# EAGLE design Moving_Head_V3.1 (EAGLE 9.3.0)

## Sheet 1 of 2
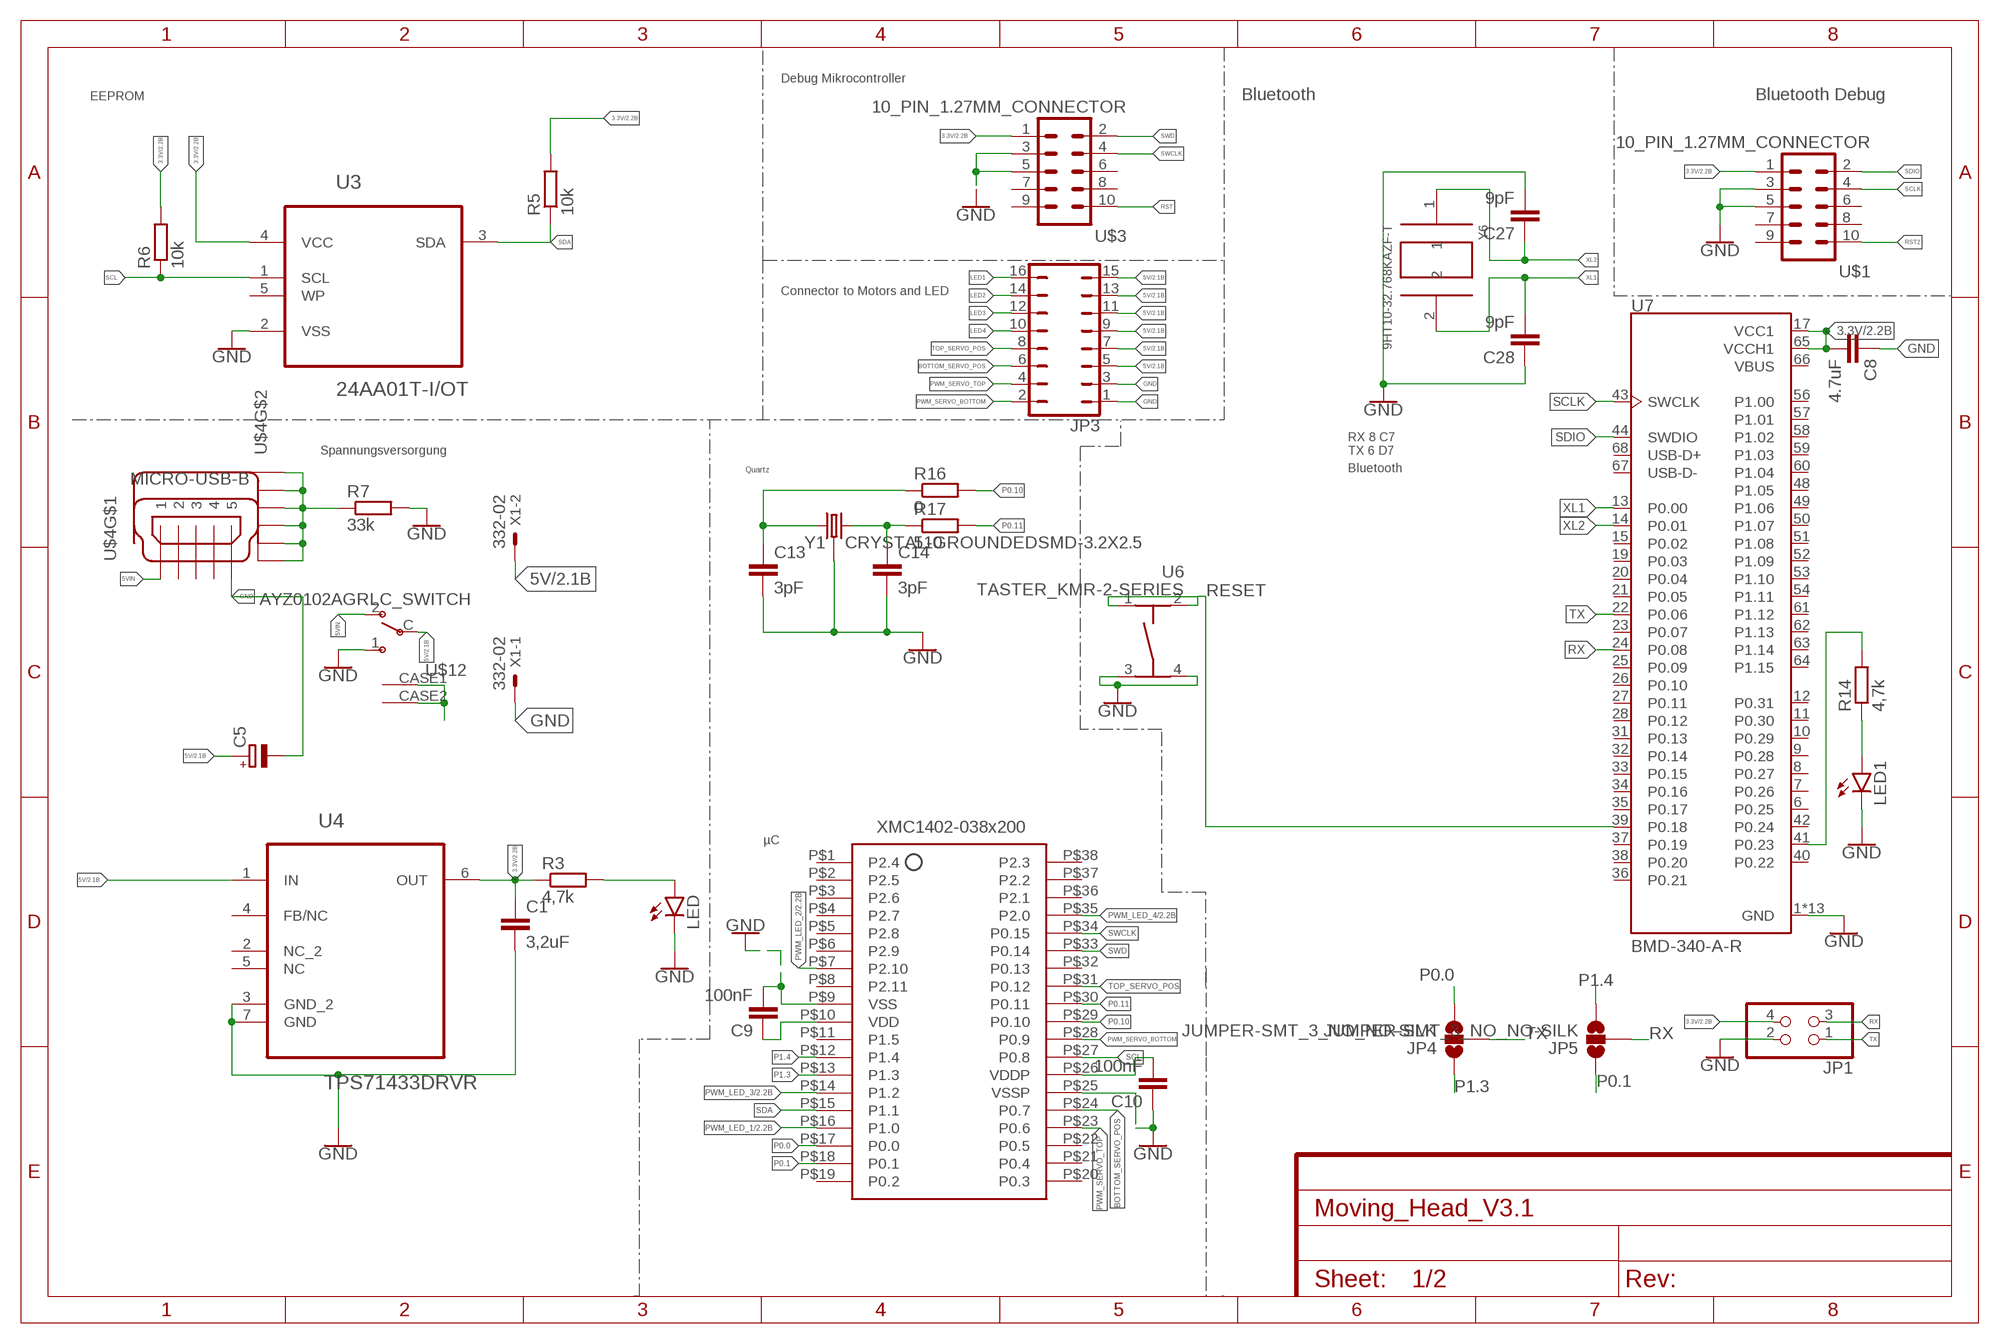
[diagram p0: schematic, sheet 1]

### Parts
C1  3,2uF  C-EUC0805  [C0805]
C5  CPOL-EUB/3528-21R  [B/3528-21R]
C8  4.7uF  C-EUC0805  [C0805]
C9  100nF  C-EUC0805  [C0805]
C10  100nF  C-EUC0805  [C0805]
C13  3pF  C-EUC0805  [C0805]
C14  3pF  C-EUC0805  [C0805]
C27  9pF  C-EUC0805  [C0805]
C28  9pF  C-EUC0805  [C0805]
JP1  PINHD-2X2  [2X02]
JP3  JUMPER_JP8Q  [JUMPER_JP8Q]
JP4  JUMPER-SMT_3_NO_NO-SILK  [SMT-JUMPER_3_NO_NO-SILK]
JP5  JUMPER-SMT_3_NO_NO-SILK  [SMT-JUMPER_3_NO_NO-SILK]
LED  LEDCHIPLED_0805  [CHIPLED_0805]
LED1  SML-H12V8TT86  LEDCHIPLED_0805  [CHIPLED_0805]
R3  4,7k  R-EU_R0805  [R0805]
R5  10k  R-EU_R0805  [R0805]
R6  10k  R-EU_R0805  [R0805]
R7  33k  R-EU_R0805  [R0805]
R14  4,7k  R-EU_R0805  [R0805]
R16  0  R-EU_R0805  [R0805]
R17  510  R-EU_R0805  [R0805]
U3  24AA01T-I/OT  [SOT95P270X145-5N]
U4  TPS71433DRVR  [SON65P200X200X80-7N]
U5  XMC1400_38P  [XMC1400_38P]
U6  TASTER_KMR-2-SERIES  [KMR-2-SERIES]
U7  BMD-340-A-R  [RIGADO_BMD-340-A-R]
U$1  10_PIN_1.27MM_CONNECTOR  [10_PIN_1.27MM]
U$3  10_PIN_1.27MM_CONNECTOR  [10_PIN_1.27MM]
U$4  MICRO-USB-B  [MICRO_USB_B]
U$12  AYZ0102AGRLC_SWITCH  [AYZ0102AGRLC]
X1  332-02  [332-02]
Y1  CRYSTAL-GROUNDEDSMD-3.2X2.5  [CRYSTAL-SMD-3.2X2.5MM]
Y6  9HT10-32.768KAZF-T  [XTAL320X150X75]

### Nets
3.3V: C1.1 C8.2 C9.1 C10.2 JP1.4 R3.1 R5.2 R6.2 U3.4(VCC) U4.6(OUT) U5.P$10(VDD) U5.P$26(VDDP) U7.17(VCC1) U7.65(VCCH1) U$1.1 U$3.1 ; also sheet 2
5V: C5.+ JP3.5 JP3.7 JP3.9 JP3.11 JP3.13 JP3.15 U4.1(IN) U$12.C X1.2 ; also sheet 2
5VIN: U$4.1 U$12.2
BOTTOM_SERVO_POS: JP3.6 U5.P$24(P0.7)
GND: C1.2 C5.- C8.1 C9.2 C10.1 C13.2 C14.2 C27.2 C28.1 JP1.2 JP3.1 JP3.3 LED1.C LED.C R7.2 U3.2(VSS) U4.3(GND_2) U4.7(GND) U5.P$9(VSS) U5.P$25(VSSP) U6.3 U6.4 U7.1(GND) U7.2(GND) U7.3(GND) U7.4(GND) U7.5(GND) U7.16(GND) U7.18(GND) U7.29(GND) U7.30(GND) U7.45(GND) U7.46(GND) U7.47(GND) U7.55(GND) U$1.3 U$1.5 U$3.3 U$3.5 U$4.5 U$12.1 U$12.CASE1 U$12.CASE2 X1.1 Y1.2 Y1.4 ; also sheet 2
LED1: JP3.16 ; also sheet 2
LED2: JP3.14 ; also sheet 2
LED3: JP3.12 ; also sheet 2
LED4: JP3.10 ; also sheet 2
N$1: R14.2 U7.41(P0.23)
N$2: LED1.A R14.1
N$4: LED.A R3.2
N$6: R7.1 U$4.P$1(S1) U$4.P$2(S2) U$4.P$6(S3) U$4.P$7(S4) U$4.P$9(S5) U$4.P$10(S6)
N$29: C14.1 R17.1 Y1.3
N$30: C13.1 R16.1 Y1.1
P0.0: JP4.3 U5.P$17(P0.0)
P0.1: JP5.1 U5.P$18(P0.1)
P0.10: R16.2 U5.P$29(P0.10)
P0.11: R17.2 U5.P$30(P0.11)
P1.3: JP4.1 U5.P$13(P1.3)
P1.4: JP5.3 U5.P$12(P1.4)
PWM_LED_1: U5.P$16(P1.0) ; also sheet 2
PWM_LED_2: U5.P$7(P2.10) ; also sheet 2
PWM_LED_3: U5.P$14(P1.2) ; also sheet 2
PWM_LED_4: U5.P$35(P2.0) ; also sheet 2
PWM_SERVO_BOTTOM: JP3.2 U5.P$28(P0.9)
PWM_SERVO_TOP: JP3.4 U5.P$23(P0.6)
RESET: U6.1 U6.2 U7.39(P0.18)
RST: U$3.10
RST2: U$1.10
RX: JP1.3 JP5.2 U7.24(P0.08)
SCL: R6.1 U3.1(SCL) U5.P$27(P0.8)
SCLK: U7.43(SWCLK) U$1.4
SDA: R5.1 U3.3(SDA) U5.P$15(P1.1)
SDIO: U7.44(SWDIO) U$1.2
SWCLK: U5.P$34(P0.15) U$3.4
SWD: U5.P$33(P0.14) U$3.2
TOP_SERVO_POS: JP3.8 U5.P$31(P0.12)
TX: JP1.1 JP4.2 U7.22(P0.06)
XL1: C28.2 U7.13(P0.00) Y6.2
XL2: C27.1 U7.14(P0.01) Y6.1
Unconnected: U3.5(WP) U4.2(NC_2) U4.4(FB/NC) U4.5(NC) U5.P$1(P2.4) U5.P$2(P2.5) U5.P$3(P2.6) U5.P$4(P2.7) U5.P$5(P2.8) U5.P$6(P2.9) U5.P$8(P2.11) U5.P$11(P1.5) U5.P$19(P0.2) U5.P$20(P0.3) U5.P$21(P0.4) U5.P$22(P0.5) U5.P$32(P0.13) U5.P$36(P2.1) U5.P$37(P2.2) U5.P$38(P2.3) U7.6(P0.25) U7.7(P0.26) U7.8(P0.27) U7.9(P0.28) U7.10(P0.29) U7.11(P0.30) U7.12(P0.31) U7.15(P0.02) U7.19(P0.03) U7.20(P0.04) U7.21(P0.05) U7.23(P0.07) U7.25(P0.09) U7.26(P0.10) U7.27(P0.11) U7.28(P0.12) U7.31(P0.13) U7.32(P0.14) U7.33(P0.15) U7.34(P0.16) U7.35(P0.17) U7.36(P0.21) U7.37(P0.19) U7.38(P0.20) U7.40(P0.22) U7.42(P0.24) U7.48(P1.05) U7.49(P1.06) U7.50(P1.07) U7.51(P1.08) U7.52(P1.09) U7.53(P1.10) U7.54(P1.11) U7.56(P1.00) U7.57(P1.01) U7.58(P1.02) U7.59(P1.03) U7.60(P1.04) U7.61(P1.12) U7.62(P1.13) U7.63(P1.14) U7.64(P1.15) U7.67(USB-D-) U7.68(USB-D+) U$1.6 U$1.7 U$1.8 U$1.9 U$3.6 U$3.7 U$3.8 U$3.9 U$4.2 U$4.3 U$4.4

### Notes on the sheet
- Debug Mikrocontroller
- EEPROM | Bluetooth | Bluetooth Debug
- Connector to Motors and LED
- Spannungsversorgung
- RX 8 C7
  TX 6 D7
- Quartz | Bluetooth
- µC

## Sheet 2 of 2
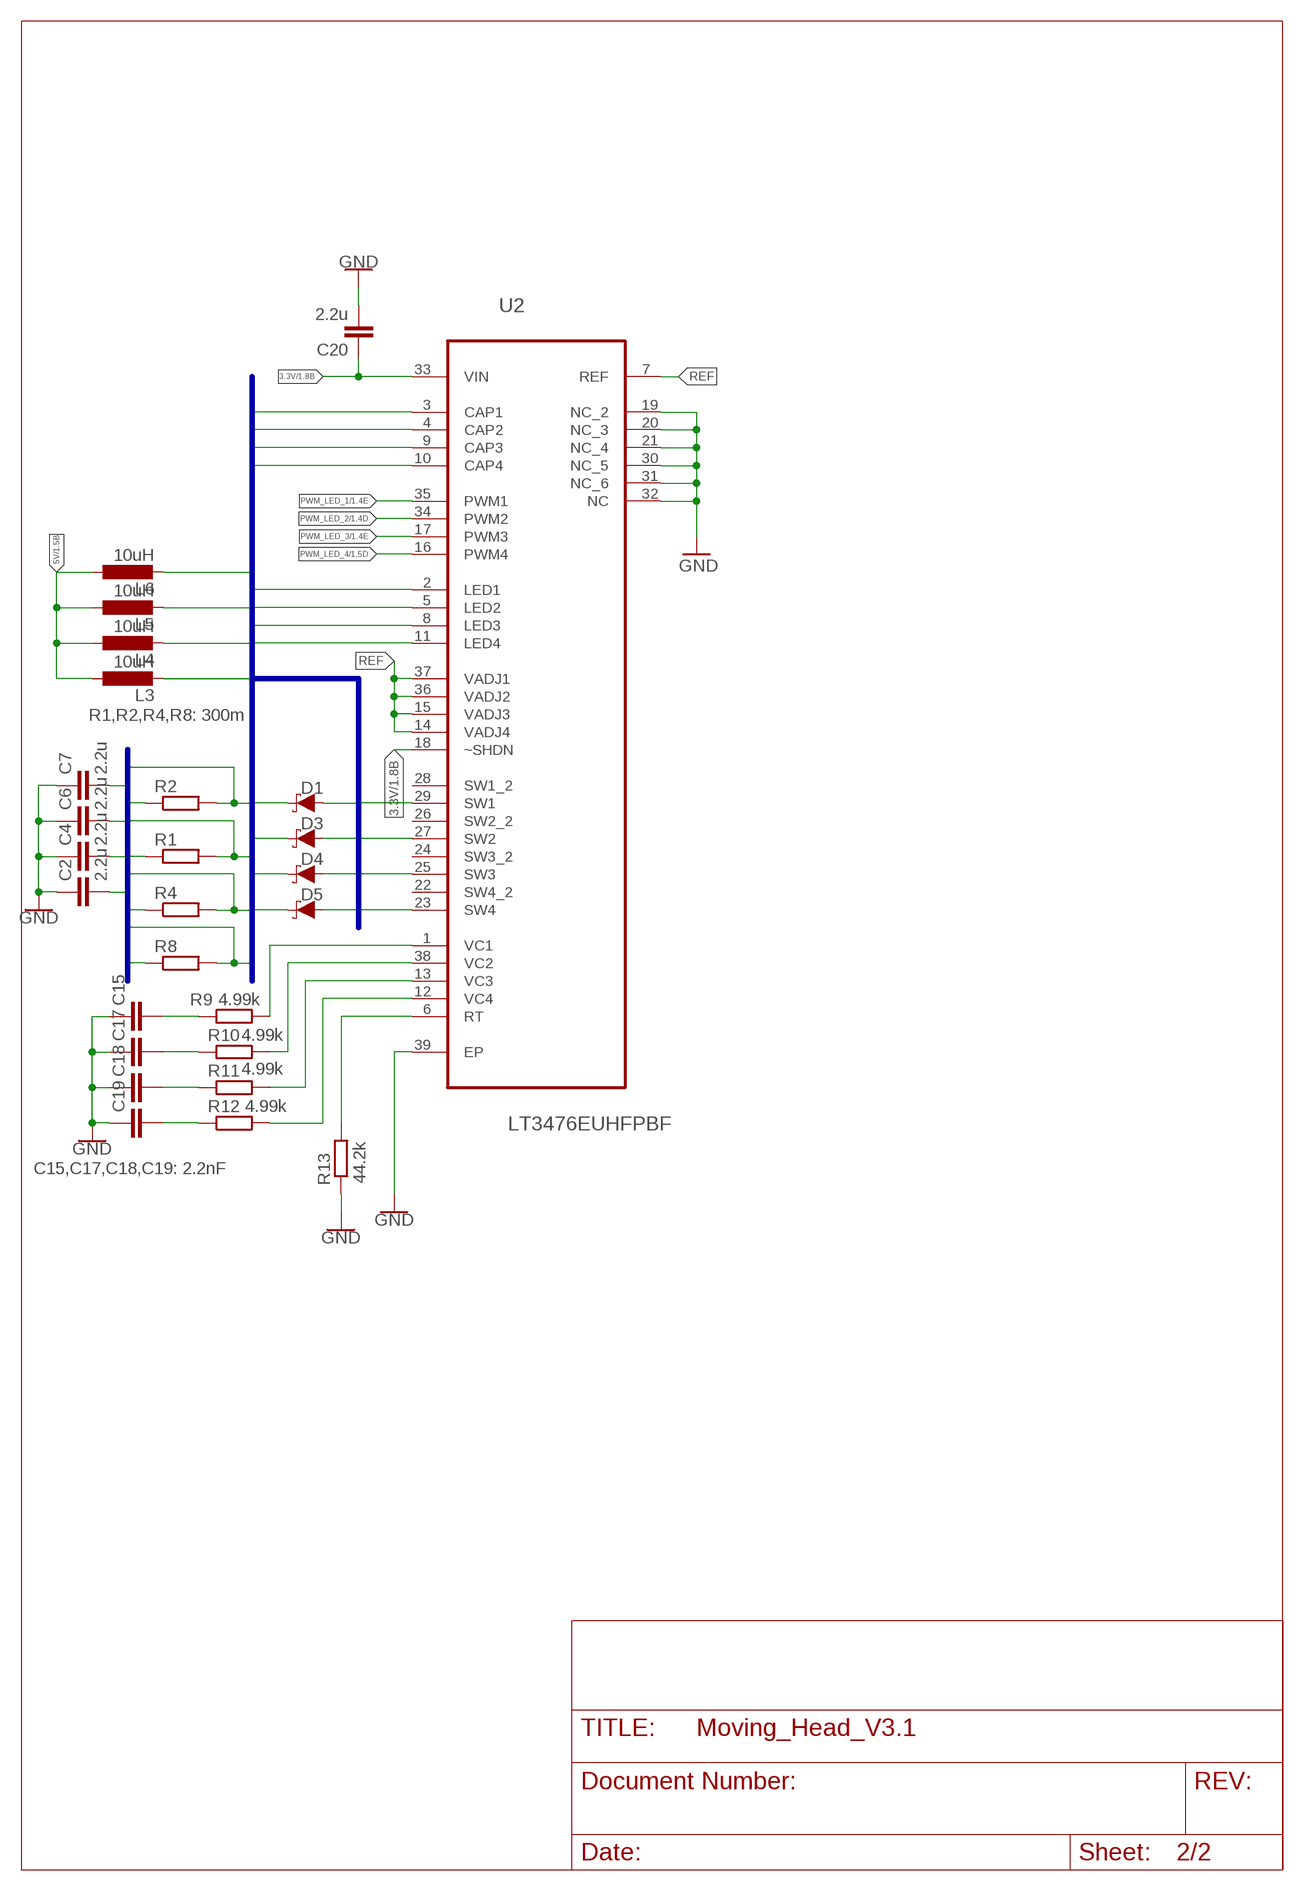
[diagram p1: schematic, sheet 2]

### Parts
C2  2.2u  C-EUC0805  [C0805]
C4  2.2u  C-EUC0805  [C0805]
C6  2.2u  C-EUC0805  [C0805]
C7  2.2u  C-EUC0805  [C0805]
C15  2.2n  C-EUC0805  [C0805]
C17  2.2n  C-EUC0805  [C0805]
C18  2.2n  C-EUC0805  [C0805]
C19  2.2n  C-EUC0805  [C0805]
C20  2.2u  C-EUC0805  [C0805]
D1  1A/23V/620mV  DIODE-SCHOTTKY-BAT20J  [SOD-323]
D3  1A/23V/620mV  DIODE-SCHOTTKY-BAT20J  [SOD-323]
D4  1A/23V/620mV  DIODE-SCHOTTKY-BAT20J  [SOD-323]
D5  1A/23V/620mV  DIODE-SCHOTTKY-BAT20J  [SOD-323]
L3  10uH  L-EUL2012C  [L2012C]
L4  10uH  L-EUL2012C  [L2012C]
L5  10uH  L-EUL2012C  [L2012C]
L6  10uH  L-EUL2012C  [L2012C]
R1  300m  R-EU_M0805  [M0805]
R2  300m  R-EU_M0805  [M0805]
R4  300m  R-EU_M0805  [M0805]
R8  300m  R-EU_M0805  [M0805]
R9  4.99k  R-EU_M0805  [M0805]
R10  4.99k  R-EU_M0805  [M0805]
R11  4.99k  R-EU_M0805  [M0805]
R12  4.99k  R-EU_M0805  [M0805]
R13  44.2k  R-EU_M0805  [M0805]
U2  LT3476EUHFPBF  [QFN50P500X700X80-39N]

### Nets
3.3V: C20.1 U2.18(~SHDN) U2.33(VIN) ; also sheet 1
5V: L3.1 L4.1 L5.1 L6.1 ; also sheet 1
CAP1: C7.2 D1.C R2.2 U2.3(CAP1)
CAP2: C6.2 D3.C R1.2 U2.4(CAP2)
CAP3: C4.2 D4.C R4.2 U2.9(CAP3)
CAP4: C2.2 D5.C R8.2 U2.10(CAP4)
GND: C2.1 C4.1 C6.1 C7.1 C15.1 C17.1 C18.1 C19.1 C20.2 R13.1 U2.19(NC_2) U2.20(NC_3) U2.21(NC_4) U2.30(NC_5) U2.31(NC_6) U2.32(NC) U2.39(EP) ; also sheet 1
LED1: R2.1 U2.2(LED1) ; also sheet 1
LED2: R1.1 U2.5(LED2) ; also sheet 1
LED3: R4.1 U2.8(LED3) ; also sheet 1
LED4: R8.1 U2.11(LED4) ; also sheet 1
N$8: R9.2 U2.1(VC1)
N$10: R10.2 U2.38(VC2)
N$12: R11.2 U2.13(VC3)
N$15: R12.2 U2.12(VC4)
N$16: R13.2 U2.6(RT)
N$17: C15.2 R9.1
N$18: C17.2 R10.1
N$19: C18.2 R11.1
N$20: C19.2 R12.1
PWM_LED_1: U2.35(PWM1) ; also sheet 1
PWM_LED_2: U2.34(PWM2) ; also sheet 1
PWM_LED_3: U2.17(PWM3) ; also sheet 1
PWM_LED_4: U2.16(PWM4) ; also sheet 1
REF: U2.7(REF) U2.14(VADJ4) U2.15(VADJ3) U2.36(VADJ2) U2.37(VADJ1)
SW1: D1.A L6.2 U2.29(SW1)
SW2: D3.A L5.2 U2.27(SW2)
SW3: D4.A L4.2 U2.25(SW3)
SW4: D5.A L3.2 U2.23(SW4)
Unconnected: U2.22(SW4_2) U2.24(SW3_2) U2.26(SW2_2) U2.28(SW1_2)

### Buses
CAP1,CAP2,CAP3,CAP4,LED1,LED2,LED3,LED4,SW1,SW2,SW3,SW4

### Notes on the sheet
- R1,R2,R4,R8: 300m
- C15,C17,C18,C19: 2.2nF

## Power pins joined to a net without a drawn wire
VBUS: U7.66(VBUS)

## Library data of the parts
C1 C9 C10 C27 C28 = rcl:C-EU: CAPACITOR, European symbol
C2 C4 C6 C7 C15 C17-C20 = rcl:C-EU: CAPACITOR, European symbol; SPICEPREFIX: C
C5 = rcl:CPOL-EU: POLARIZED CAPACITOR, European symbol; SPICEPREFIX: C
C8 C13 C14 = rcl@1:C-EU: CAPACITOR, European symbol
D1 D3-D5 = SparkFun-DiscreteSemi:DIODE-SCHOTTKY: Schottky diode A Schottky diode is a semiconductor diode which has a low forward voltage drop and a very fast switching action.; PROD_ID: DIO-11623
JP1 = pinhead:PINHD-2X2: PIN HEADER
JP3 = Moving_Head_V3:JUMPER_JP8Q: JUMPER
JP4 JP5 = SparkFun-Jumpers:JUMPER-SMT_3_NO: Normally open jumper This jumper has three pads in close proximity to each other. Apply solder to close the connection(s).
L3-L6 = rcl:L-EU: INDUCTOR, European symbol; SPICEPREFIX: L
LED LED1 = led:LED: LED OSRAM: - CHIPLED LG R971, LG N971, LY N971, LG Q971, LY Q971, LO R971, LY R971 LH N974, LH R974 LS Q976, LO Q976, LY Q976 LO Q996 - Hyper CHIPLED LW Q18S LB Q993, LB Q99A, LB R99A - SideLED LS A670, LO A670, LY A670, LG A670, LP A670 LB A673, LV A673, LT A673, LW A673 LH A674 LY A675 LS A676, LA A676, LO A676, LY A676, LW A676 LS A679, LY A679, LG A679 - Hyper Micro SIDELED® LS Y876, LA Y876, LO Y876, LY Y876 LT Y87S - SmartLED LW L88C, LW L88S LB L89C, LB L89S, LG L890 LS L89K, LO L89K, LY L89K LS L896, LA L896, LO L896, LY L896 - TOPLED LS T670, LO T670, LY T670, LG T670, LP T670 LSG T670, LSP T670, LSY T670, LOP T670, LYG T670 LG T671, LOG T671, LSG T671 LB T673, LV T673, LT T673, LW T673 LH T674 LS T676, LA T676, LO T676, LY T676, LB T676, LH T676, LSB T676, LW T676 LB T67C, LV T67C, LT T67C, LS T67K, LO T67K, LY T67K, LW E67C LS E67B, LA E67B, LO E67B, LY E67B, LB E67C, LV E67C, LT E67C LW T67C LS T679, LY T679, LG T679 LS T770, LO T770, LY T770, LG T770, LP T770 LB T773, LV T773, LT T773, LW T773 LH T774 LS E675, LA E675, LY E675, LS T675 LS T776, LA T776, LO T776, LY T776, LB T776 LHGB T686 LT T68C, LB T68C - Hyper Mini TOPLED® LB M676 - Mini TOPLED Santana® LG M470 LS M47K, LO M47K, LY M47K Source: http://www.osram.convergy.de LUXEON: - LUMILED® LXK2-PW12-R00, LXK2-PW12-S00, LXK2-PW14-U00, LXK2-PW14-V00 LXK2-PM12-R00, LXK2-PM12-S00, LXK2-PM14-U00 LXK2-PE12-Q00, LXK2-PE12-R00, LXK2-PE12-S00, LXK2-PE14-T00, LXK2-PE14-U00 LXK2-PB12-K00, LXK2-PB12-L00, LXK2-PB12-M00, LXK2-PB14-N00, LXK2-PB14-P00, LXK2-PB14-Q00 LXK2-PR12-L00, LXK2-PR12-M00, LXK2-PR14-Q00, LXK2-PR14-R00 LXK2-PD12-Q00, LXK2-PD12-R00, LXK2-PD12-S00 LXK2-PH12-R00, LXK2-PH12-S00 LXK2-PL12-P00, LXK2-PL12-Q00, LXK2-PL12-R00 Source: www.luxeon.com KINGBRIGHT: KA-3528ASYC Source: www.kingbright.com
R1-R14 = rcl:R-EU_: RESISTOR, European symbol; SPICEPREFIX: R
R16 R17 = rcl@1:R-EU_: RESISTOR, European symbol
U2 = LT3476EUHFPBF:LT3476EUHFPBF: Quad Output LED Driver; AVAILABILITY: Unavailable; DESCRIPTION: Ic Led Drvr Hp Const Curr 38-Qfn - Lt3476euhf#Pbf; MF: Linear Technology; MP: LT3476EUHF#PBF; PACKAGE: QFN-38 Linear Technology; PRICE: None
U3 = Microchip_By_element14_Batch_1:24AA01T-I/OT: EEPROM; DESCRIPTION: Serial EEPROM; MPN: 24AA01T-I/OT; OC_FARNELL: 1331269; OC_NEWARK: 72C4376; PACKAGE: SOT-5; SUPPLIER: Microchip
U4 = 1_MynewBib:TPS71433DRVR: LOW-DROPOUT LINEAR REGULATOR; AVAILABILITY: Good; DESCRIPTION: 80mA, 10V, Quiescent Current 3.0?A, LDO Linear Regulator in SC70 or SON2x2 6-WSON -40 to 125; MF: Texas Instruments; MP: TPS71433DRVR; PACKAGE: SON-6 Texas Instruments; PRICE: 0.41 USD
U5 = 1_MynewBib:XMC1400_38P
U6 = own-taster:TASTER_KMR-2-SERIES: KMR-2 Series Taster, Mini SMD 4.6x2.2mm, 1.2-4N Supplier: C&K Components Sale: Farnell Example:KMR211G LFS , 1.2N
U7 = BMD-340-A-R:BMD-340-A-R: Bluetooth Low Energy 5.0 Module; AVAILABILITY: Unavailable; DESCRIPTION: Bluetooth Low Energy 5.0 Module; MF: Rigado, Inc.; MP: BMD-340-A-R; PACKAGE: Module Rigado; PRICE: None
U$1 U$3 = own-connectors:10_PIN_1.27MM_CONNECTOR: Board-toBoard-Steckverbinder, 1.27MM Rastermaß Hersteller: Amphenol z.B.: Modell 20021111-00010T4LF von FCI
U$4 = own-connectors:MICRO-USB-B: Molex Micro Usb TYP-B Buchse, 5polig Produkt: MOLEX 105017-0001, Farnell Link: http://www.molex.com/molex/products/datasheet.jsp?part=active/1050170001_IO_CONNECTORS.xml&channel=Products&Lang=en-US
U$12 = own-poti-switches:AYZ0102AGRLC_SWITCH: AYZ0102AGLC SPDT Switch On-On, Small, 100mA, 12V Supplier: C&K Components Sale: Farnell
X1 = con-garry:332-02: 2 Pin - 2mm Dual Row Source: www.mpe-connector.de / garry_shortform_2012.pdf
Y1 = SparkFun-Clocks:CRYSTAL-GROUNDED: Crystals w/ Ground Pin (Generic) These are passive quartz crystals, which can be used as a clock source for a microcontroller. Crystal's are usually two-terminal devices. A third terminal may be optionally connected to ground, as recommended by the manufaturer.
Y6 = 9HT10-32.768KAZF-T:9HT10-32.768KAZF-T: Crystal, 32.768khz, 12.5pf, 3.2 x 1.5mm

## Board
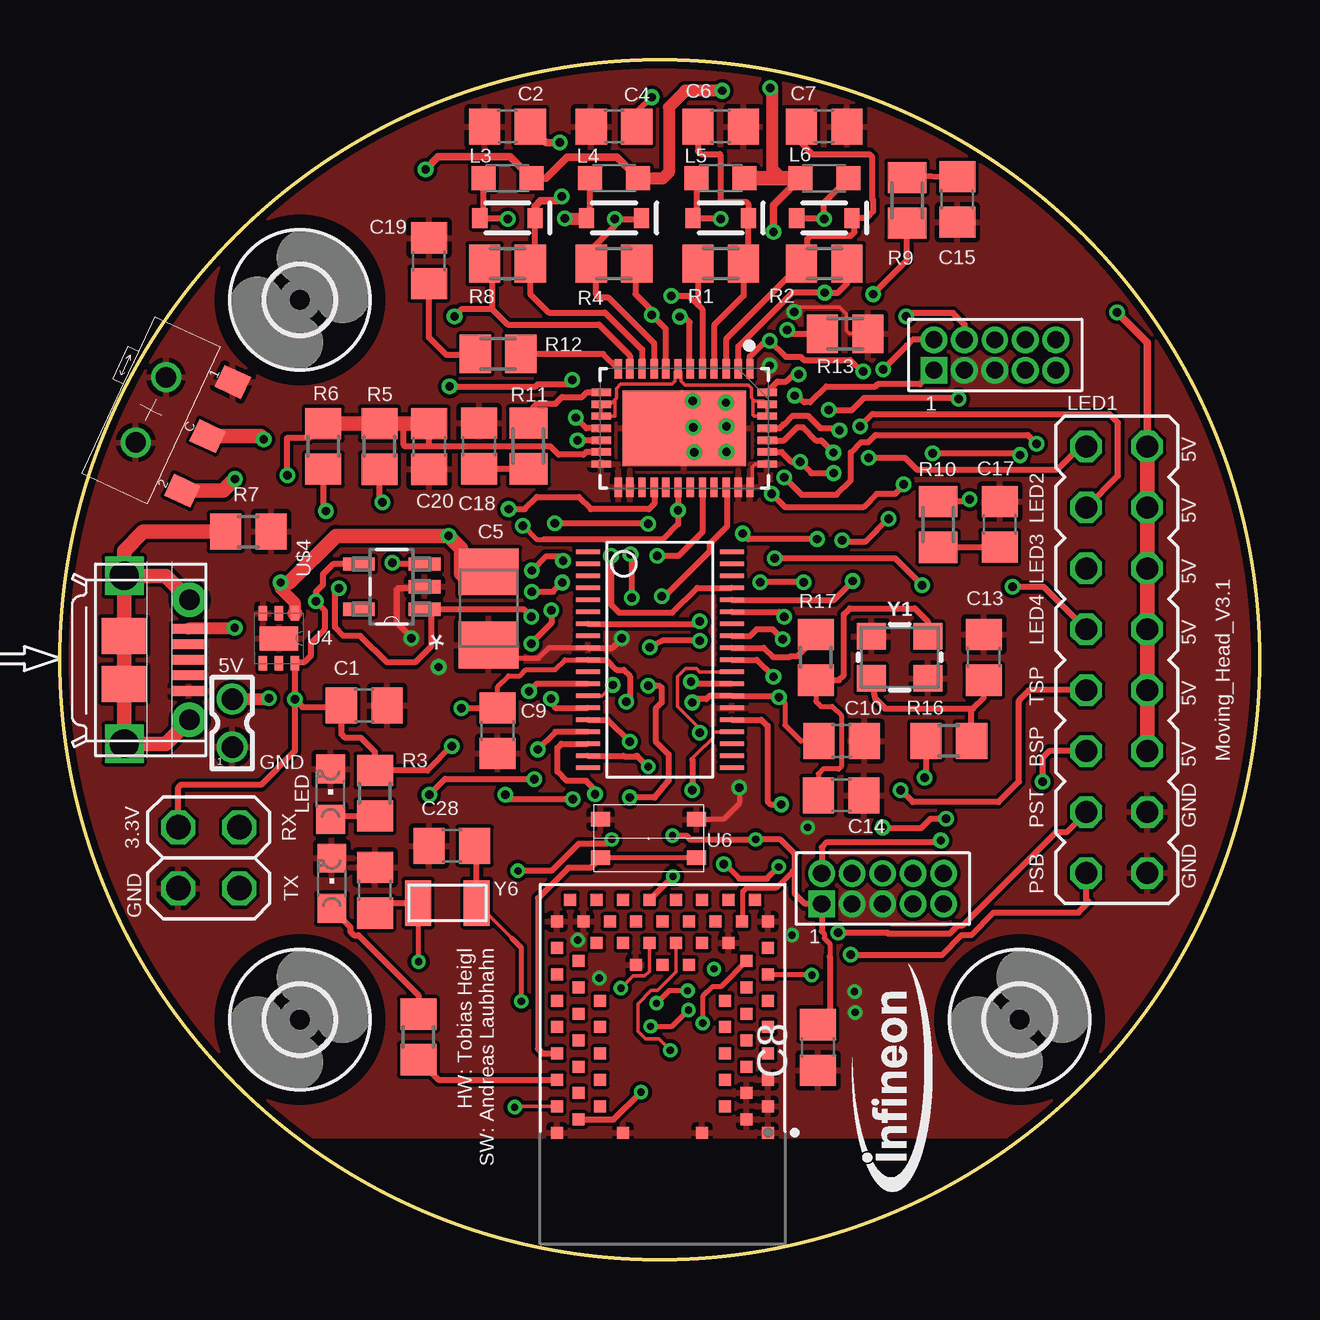
[diagram p2: board, top side]
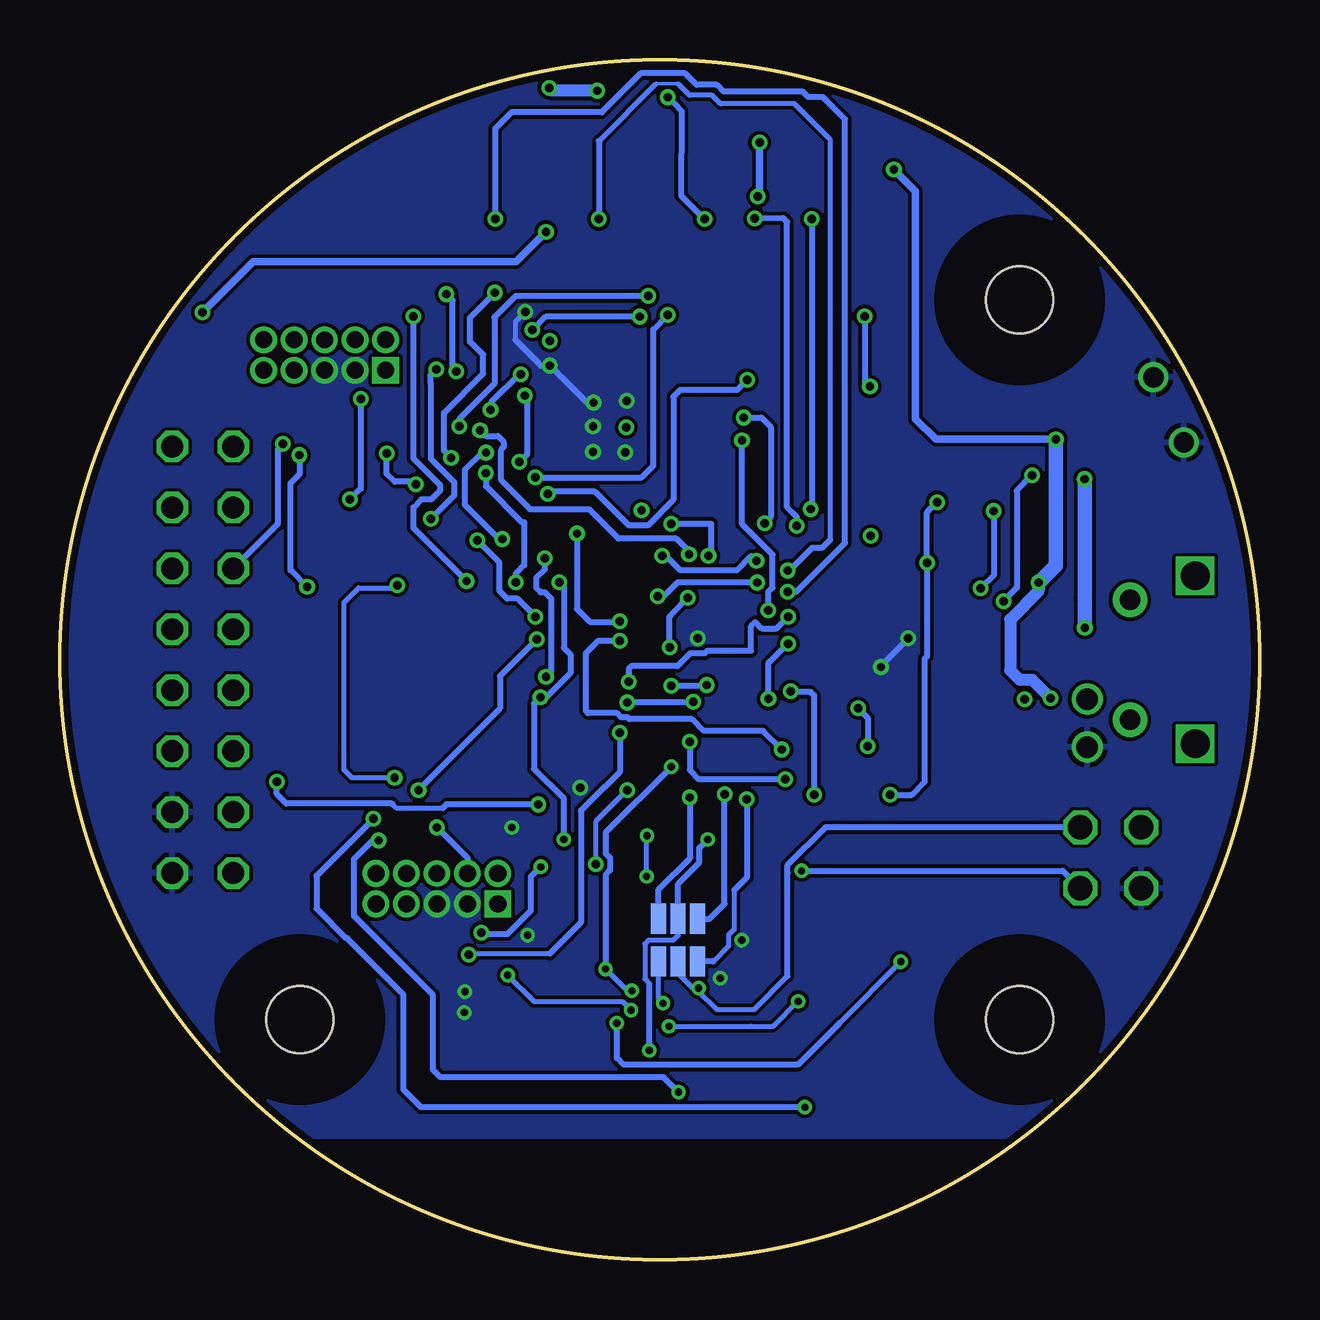
[diagram p3: board, bottom side, seen from below]

Size 50 x 50 mm. Coordinates in mm from the lower left corner, seen from the top.
Outline: circle at 25,25 radius 25
Copper layers (1*16): Top 0.035mm / dielectric 1.5mm / Bottom 0.035mm
Design rules "PCB-POOL Standard *": minimum track width 0.15mm, minimum drill 0.3mm, track to track 0.15mm, track to pad 0.15mm, pad to pad 0.15mm, via to via 0.15mm, smd to smd 0.15mm, copper to edge 0.3mm, drill to drill 0.2mm, minimum pad ring 0.2mm, minimum via ring 0.15mm, stop-mask expansion 0.075mm, vias tented up to drill 0.35mm, thermal gap 0.2mm
tKeepout: area 14.5,13.9 to 17.9,15.9; area 33.1,23.5 to 37,26.6
bKeepout: area 33.1,23.5 to 37,26.6; area 33.2,23.5 to 37,26.6; area 14.5,13.8 to 17.9,15.8
tRestrict: area 8.4,-6.5 to 41.6,4.8
bRestrict: area 8.2,-6.5 to 41.3,4.8

### Footprints (pad centres in the part's own frame; a part is rotated, then mirrored left to right if it is on the bottom)
C0805 = smd 1.3 x 1.5: 1 -0.95,0; 2 0.95,0
B/3528-21R = smd 1.95 x 2.5: + 1.525,0; - -1.525,0
SOD-323 = smd 0.63 x 0.83: A 1.15,0; C -1.15,0
2X02 = drill 1.016 octagon: 1 -1.27,-1.27; 2 -1.27,1.27; 3 1.27,-1.27; 4 1.27,1.27
JUMPER_JP8Q = drill 0.914 octagon: 1 -8.89,-1.27; 2 -8.89,1.27; 3 -6.35,-1.27; 4 -6.35,1.27; 5 -3.81,-1.27; 6 -3.81,1.27; 7 -1.27,-1.27; 8 -1.27,1.27; 9 1.27,-1.27; 10 1.27,1.27; 11 3.81,-1.27; 12 3.81,1.27; 13 6.35,-1.27; 14 6.35,1.27; 15 8.89,-1.27; 16 8.89,1.27
SMT-JUMPER_3_NO_NO-SILK = smd 0.635 x 1.27: 1 -0.813,0; 2 0,0; 3 0.813,0
L2012C = smd 1 x 1: 1 -1,0; 2 1,0
CHIPLED_0805 = smd 1.2 x 1.2: A 0,-1.05; C 0,1.05
M0805 = smd 1.3 x 1.6: 1 -0.95,0; 2 0.95,0
R0805 = smd 1.3 x 1.5: 1 -0.95,0; 2 0.95,0
QFN50P500X700X80-39N = smd 0.813 x 0.305: 1 -2.464,2.743; 2 -2.464,2.261; 3 -2.464,1.753; 4 -2.464,1.245; 5 -2.464,0.762; 6 -2.464,0.254; 7 -2.464,-0.254; 8 -2.464,-0.762; 9 -2.464,-1.245; 10 -2.464,-1.753; 11 -2.464,-2.261; 12 -2.464,-2.743; 20 2.464,-2.743; 21 2.464,-2.261; 22 2.464,-1.753; 23 2.464,-1.245; 24 2.464,-0.762; 25 2.464,-0.254; 26 2.464,0.254; 27 2.464,0.762; 28 2.464,1.245; 29 2.464,1.753; 30 2.464,2.261; 31 2.464,2.743 | smd 0.305 x 0.813: 13 -1.499,-3.454; 14 -0.991,-3.454; 15 -0.508,-3.454; 16 0,-3.454; 17 0.508,-3.454; 18 0.991,-3.454; 19 1.499,-3.454; 32 1.499,3.454; 33 0.991,3.454; 34 0.508,3.454; 35 0,3.454; 36 -0.508,3.454; 37 -0.991,3.454; 38 -1.499,3.454 | smd 3.15 x 5.156: 39 0,0
SOT95P270X145-5N = smd 1.321 x 0.559: 1 -1.372,0.94; 2 -1.372,0; 3 -1.372,-0.94; 4 1.372,-0.94; 5 1.372,0.94
SON65P200X200X80-7N = smd 0.61 x 0.356: 1 -1.041,0.66; 2 -1.041,0; 3 -1.041,-0.66; 4 1.041,-0.66; 5 1.041,0; 6 1.041,0.66 | smd 0.991 x 1.6: 7 0,0
XMC1400_38P = smd 1 x 0.2: P$1 -3,4.5; P$2 -3,4; P$3 -3,3.5; P$4 -3,3; P$5 -3,2.5; P$6 -3,2; P$7 -3,1.5; P$8 -3,1; P$9 -3,0.5; P$10 -3,0; P$11 -3,-0.5; P$12 -3,-1; P$13 -3,-1.5; P$14 -3,-2; P$15 -3,-2.5; P$16 -3,-3; P$17 -3,-3.5; P$18 -3,-4; P$19 -3,-4.5; P$20 3,-4.5; P$21 3,-4; P$22 3,-3.5; P$23 3,-3; P$24 3,-2.5; P$25 3,-2; P$26 3,-1.5; P$27 3,-1; P$28 3,-0.5; P$29 3,0; P$30 3,0.5; P$31 3,1; P$32 3,1.5; P$33 3,2; P$34 3,2.5; P$35 3,3; P$36 3,3.5; P$37 3,4; P$38 3,4.5
KMR-2-SERIES = smd 0.8 x 0.6: 1 -2,0.8; 2 2,0.8; 3 -2,-0.8; 4 2,-0.8
RIGADO_BMD-340-A-R = smd 0.5 x 0.5: 1 -2.85,-4.4; 2 -2.3,-3.5; 3 -1.75,-4.4; 4 -1.2,-3.5; 5 -0.65,-4.4; 6 -0.1,-3.5; 7 0.45,-4.4; 8 1,-3.5; 9 1.55,-4.4; 10 2.1,-3.5; 11 2.65,-4.4; 12 3.2,-3.5; 13 3.75,-4.4; 14 4.3,-3.5; 15 4.85,-4.4; 16 5.95,-4.4; 17 5.95,-3.3; 18 5.05,-2.75; 19 5.95,-2.2; 20 5.05,-1.65; 21 5.95,-1.1; 22 5.05,-0.55; 23 5.95,0; 24 5.05,0.55; 25 5.95,1.1; 26 5.05,1.65; 27 5.95,2.2; 28 5.05,2.75; 29 5.95,3.3; 30 5.95,4.4; 31 4.85,4.4; 32 4.3,3.5; 33 3.75,4.4; 34 3.2,3.5; 35 2.65,4.4; 36 2.1,3.5; 37 1.55,4.4; 38 1,3.5; 39 0.45,4.4; 40 -0.1,3.5; 41 -0.65,4.4; 42 -1.2,3.5; 43 -1.75,4.4; 44 -2.3,3.5; 45 -2.85,4.4; 46 -2.85,1.65; 47 -2.85,-1.65; 48 -1.75,-2.6; 49 -0.65,-2.6; 50 0.45,-2.6; 51 1.55,-2.6; 52 2.65,-2.6; 53 4.15,-1.1; 54 4.15,0; 55 4.15,1.1; 56 2.65,2.6; 57 1.55,2.6; 58 0.45,2.6; 59 -0.65,2.6; 60 -1.75,2.6; 61 6.85,-3.85; 62 6.85,-2.75; 63 6.85,-1.65; 64 6.85,-0.55; 65 6.85,0.55; 66 6.85,1.65; 67 6.85,2.75; 68 6.85,3.85
10_PIN_1.27MM = drill 0.71 pad 0.889 square: 1 -2.54,-0.635 | drill 0.71 pad 0.889: 2 -2.54,0.635; 3 -1.27,-0.635; 4 -1.27,0.635; 5 0,-0.635; 7 1.27,-0.635; 8 1.27,0.635; 9 2.54,-0.635; 10 2.54,0.635 | drill 0.7 pad 0.889: 6 0,0.635
MICRO_USB_B = smd 1.35 x 0.4: 1 0.68,1.3; 2 0.68,0.65; 3 0.68,0; 4 0.68,-0.65; 5 0.68,-1.3 | drill 1.2 pad 1.5 square: P$1 -2,3.5; P$2 -2,-3.5 | smd 1.9 x 1.5: P$6 -2,-1; P$7 -2,1 | drill 0.85 pad 1.45: P$9 0.72,2.5; P$10 0.72,-2.5
2,8 = hole 2.8: 0,0
AYZ0102AGRLC = smd 1 x 1.2: 1 -2.5,2.6; 2 2.5,2.6; C 0,2.6 | drill 0.85 pad 1: CASE1 -1.5,0; CASE2 1.5,0
332-02 = drill 0.9 pad 1.27: 1 0,-1; 2 0,1
CRYSTAL-SMD-3.2X2.5MM = smd 1.2 x 1.1: 1 -1.175,-0.875; 2 1.175,-0.875; 3 1.175,0.875; 4 -1.175,0.875
XTAL320X150X75 = smd 1.092 x 1.905: 1 -1.219,0; 2 1.219,0

### Placement (x,y rotation side)
C1  12.68,23.09 0 top
C2  18.65,47.23 0 top
C4  23.09,47.23 0 top
C5  17.87,27.14 90 top
C6  27.54,47.23 180 top
C7  31.86,47.23 180 top
C8  31.59,8.84 90 top
C9  18.24,22.04 270 top
C10  32.58,21.61 180 top
C13  38.5,25.1 90 top
C14  32.56,19.35 0 top
C15  37.4,44.18 90 top
C17  39.17,30.65 270 top
C18  17.47,33.91 270 top
C19  15.38,41.63 270 top
C20  15.39,33.89 270 top
C27  13.13,15.39 90 top
C28  16.33,17.25 0 top
D1  31.86,43.41 180 top
D3  27.54,43.41 180 top
D4  23.09,43.41 180 top
D5  18.65,43.41 180 top
JP1  6.2,16.74 90 top
JP3  44.05,25 90 top
JP4  24.24,14.21 0 bottom
JP5  24.24,12.43 0 bottom
L3  18.65,45.07 180 top
L4  23.09,45.07 180 top
L5  27.54,45.07 180 top
L6  31.86,45.07 0 top
LED  11.28,19.39 0 top
LED1  11.33,15.68 0 top
R1  27.54,41.51 0 top
R2  31.86,41.51 180 top
R3  13.13,19.43 270 top
R4  23.09,41.51 180 top
R5  13.32,33.89 90 top
R6  10.98,33.89 90 top
R7  7.86,30.33 0 top
R8  18.65,41.51 0 top
R9  35.31,44.15 270 top
R10  36.6,30.64 90 top
R11  19.53,33.91 90 top
R12  18.26,37.74 0 top
R13  32.73,38.59 180 top
R14  14.94,9.28 270 top
R16  37.05,21.62 180 top
R17  31.5,25.1 90 top
U2  26.02,34.65 270 top
U3  13.82,28.05 180 top
U4  9.12,25.89 270 top
U5  25,25 0 top
U6  24.53,17.55 180 top
U7  25.12,8.14 90 top
U$1  34.29,15.46 0 top
U$3  38.97,37.7 0 top
U$4  4.68,25 0 top
U$5  [2,8]  10,40 0 top
U$6  [2,8]  40,10 0 top
U$8  [2,8]  10,10 0 top
U$12  3.79,35.41 245 top
X1  7.18,22.36 0 top
Y1  35,25.1 0 top
Y6  16.15,14.86 0 top

### Tracks (layer width: path | path; a pad name or v marks a point on that pad's centre or on a via)
3.3V  (via drill 0.3, 0.35)
  Top 0.203: C9.1 18.24,23.88 18.69,24.33 19.17,24.33 19.43,24.59 20.64,24.59 21.05,25 U5.P$10 | v29.97,23.44 30.21,23.2 30.21,22.28 30.88,21.61 C10.2 | 30.63,16.3 30.51,16.18 30.51,16.14 29.86,15.49 28.62,15.49 28.47,15.34 28.47,14.14 U7.17 | 31.75,13.68 31.86,13.57 31.86,13.39 32.09,13.16 32.09,12.63
  Top 0.254: v26.35,23.22 26.49,23.36 26.94,23.36 27.08,23.5 U5.P$26 29.91,23.5 v29.97,23.44 | 11.73,23.03 11.73,21.9 11.89,21.74 12.55,21.74 13.13,21.16 R3.1 15.31,20.38 v16.33,21.4 | 11.73,23.03 C1.1 | v9.79,23.36 U4.6 9.85,24.91 10.2,24.91 10.46,25.16 10.46,25.7 11.03,26.27 11.03,27.07 v10.67,27.44 | 11.73,23.03 10.11,23.03 v9.79,23.36 | C9.1 18.21,22.96 16.75,22.96 v16.73,22.98 | 31.75,13.68 U$1.1 31.05,14.82 30.63,15.25 30.63,16.3 30.63,16.86 30.66,16.89 30.04,17.51 v29,17.51 26.27,17.51 26.11,17.67 v25.53,17.67 | R6.2 10.37,34.23 9.45,34.23 9.45,32.72 v9.48,32.69 | U3.4 11.38,28.99 10.95,28.56 10.95,28.12 10.67,27.84 v10.67,27.44 | JP1.4 4.93,19.68 5.04,19.79 8.39,19.79 9.79,21.19 v9.79,23.36 | v31,28.23 v29.19,28.23 | U$3.1 35.84,36.48 34.08,36.48 33.99,36.39 31.93,36.39 31.27,35.73 31.02,35.73 v30.63,36.01 | U2.33 30.08,33.66 30.49,33.25 v30.85,33.25 31.32,32.78 v32.25,32.78 | 10.57,27.54 v10.67,27.44 | v23.6,23.25 23.75,23.4 23.75,24.32 23.49,24.58 23.2,24.58 22.8,24.98 22.02,24.98 U5.P$10 | C8.2 32.09,10.29 32.09,12.63 | U7.65 v25.55,15.97 | U2.18 21.94,33.66 21.82,33.54 20.79,33.54 20.45,33.89 15.47,33.89 | C20.1 15.39,33.97 15.47,33.89 | 15.47,33.89 14.38,33.89 14.33,33.94 14.33,34.84
  Top 0.61: R6.2 10.78,34.84 R5.2 14.33,34.84 C20.1
  Bottom 0.203: v25.55,15.97 25.55,17.65 v25.53,17.67
  Bottom 0.254: v26.35,23.22 26.32,23.25 v23.6,23.25 | v16.73,22.98 16.33,22.58 v16.33,21.4 | v29,17.51 29,19.21 30.24,20.45 30.24,23.17 v29.97,23.44 29.72,23.44 28.72,24.44 28.72,25.22 29,25.5 29,28.04 v29.19,28.23 | v9.48,32.69 10.12,32.05 10.12,27.98 10.13,27.98 v10.67,27.44 | v31,28.23 31,28.59 30.65,28.94 30.65,30.72 30.74,30.72 32.25,32.23 v32.25,32.78 | v30.63,36.01 30.52,35.99 30.52,33.58 v30.85,33.25
5V  (via drill 0.35)
  Top 0.305: L6.1 29.74,43.95 v29.74,42.84 | v44.06,39.48 45.32,38.22 JP3.15 | L4.1 23.21,45.95 21.14,45.95 20.26,45.07 L3.1 18.76,45.96 15.77,45.96 v15.24,45.43
  Top 0.508: 9.8,26.95 9.8,27.36 9.2,27.96 v9.2,28.22 | 30.08,45.07 29.69,45.46 29.69,48.8 v29.61,48.84 | L4.1 25.13,45.07 25.38,45.32 25.38,48.03 26.07,48.72 v27.6,48.72 | X1.2 8.67,23.36 v8.71,23.4
  Top 0.61: L6.1 30.08,45.07 L5.1 | U$12.C 8.36,34.31 v8.49,34.19 | v9.2,28.22 9.56,28.22 11.5,30.16 v16.2,30.16 16.72,29.64 16.72,28.59 16.88,28.43 C5.+ | U4.1 9.8,26.95 | JP3.15 JP3.13 JP3.11 JP3.9 JP3.7 JP3.5
  Bottom 0.305: v29.74,42.84 30.99,41.59 41.95,41.59 v44.06,39.48 | v15.24,45.43 14.34,44.53 14.34,35.04 13.49,34.19 v8.49,34.19
  Bottom 0.508: v27.6,48.72 29.49,48.72 v29.61,48.84 | v8.71,23.4 9.47,24.16 10,24.16 10.39,24.55 10.39,26.68 9.2,27.88 v9.2,28.22
  Bottom 0.61: v8.49,34.19 8.49,28.93 v9.2,28.22
5VIN  (via drill 0.35)
  Top 0.508: 7.25,26.3 U$4.1
  Top 0.61: U$12.2 6.81,32.05 v7.29,32.53 | v7.28,26.33 7.25,26.3
  Bottom 0.61: v7.29,32.53 7.29,27.54 v7.29,26.34 v7.28,26.33
BOTTOM_SERVO_POS  (via drill 0.35)
  Top 0.254: U5.P$24 29.23,22.5 29.49,22.24 29.49,19.1 29.62,18.97 v30.06,18.97 | v40.96,19.91 40.96,20.92 41.23,21.19 JP3.6
  Bottom 0.203: 34.05,18.81 35.96,18.81 36.12,18.96
  Bottom 0.254: v30.06,18.97 33.89,18.97 34.05,18.81 | 36.12,18.96 36.16,19.01 40.57,19.01 40.96,19.4 v40.96,19.91
CAP1
  Top 0.254: U2.3 27.77,38.37 R2.2 31.15,41.75 31.15,42.54 31.28,42.67 32.96,42.67 33.12,42.83 33.12,43.41 | C7.2 30.91,46.52 31.36,46.07 33.74,46.07 33.85,45.96 33.85,44.2 33.89,44.16 33.89,43.68 33.62,43.41 33.12,43.41 | 33.12,43.41 D1.C
CAP2
  Top 0.254: U2.4 27.26,38.95 28.49,40.17 R1.2 28.69,41.71 D3.C 28.69,43.99 28.59,44.09 27.59,44.09 27.53,44.15 27.53,46.05 27.5,46.08 26.71,46.08 26.59,46.2 C6.2
CAP3  (via drill 0.35)
  Top 0.254: R4.2 22.17,41.48 | 22.17,41.48 22.33,41.32 22.33,40.24 22.46,40.11 22.84,40.11 24.77,38.18 U2.9 | 22.17,41.48 22.17,42.14 23.13,43.1 v23.13,43.37 24.2,43.37 D4.C | v24.66,48.45 24.05,47.86 C4.2
  Bottom 0.254: v23.13,43.37 24.11,44.35 24.09,47.86 24.64,48.46 v24.66,48.45
CAP4  (via drill 0.35)
  Top 0.254: D5.C 19.8,41.71 R8.2 19.6,40.24 20.36,39.48 22.71,39.48 24.26,37.93 U2.10
  Top 0.305: C2.2 20.27,46.56 v20.84,46.56 | v20.91,44.31 20.73,44.13 20.04,44.13 19.8,43.89 D5.C
  Bottom 0.305: v20.84,46.56 20.84,44.38 v20.91,44.31
GND  (via drill 0.3, 0.35)
  Top 0.152: v30.61,39.5 30.8,39.69 32.49,39.69 32.78,39.4 32.78,38.72 32.91,38.59 R13.1 | U2.32 28.97,33.15 28.86,33.04 28.86,32.29 U2.31
  Top 0.2: 33.63,39.17 33.68,39.17
  Top 0.203: 18.94,25.1 18.15,25.1 C5.- 18.18,25.07 19.95,25.07 20.38,25.5 U5.P$9 | v28.32,19.67 28.32,19.02 27.65,18.35 U6.3
  Top 0.254: U5.P$9 23.03,25.5 v23.42,25.89 | U3.2 15.12,27.97 14.08,27.97 | 14.03,27.92 14.03,26.55 14.64,25.94 v14.64,25.89 | 33.68,39.17 R13.1 33.68,39.15
  Bottom 0.203: v30.61,39.5 31.03,39.08 31.03,38.34
  Bottom 0.254: 14.88,25.89 v14.64,25.89 15.62,24.91 15.8,24.91 15.78,24.89 v15.78,24.7 | v27.76,35.72 28.04,35.72 v29.58,37.26 29.95,37.26 31.03,38.34
  other vias: 26.43,33.64 26.37,35.79 27.78,34.73 27.78,33.67 22.48,11.73 21.58,13.31 33.12,11.17 33.15,10.3 30.51,13.52 31.17,18.01
  pour Bottom: -4.21,54.21 -4.21,-4.21 56.75,-4.21 56.75,55.48 -4.21,55.48
  pour Top: -2.94,-2.94 -2.94,54.21 55.48,54.21 55.48,-2.94
LED1  (via drill 0.35)
  Top 0.254: U2.2 28.28,38.06 30.52,40.3 v31.87,40.3 32.43,40.3 32.81,40.68 R2.1 | v33.7,33.42 35.22,33.42 35.73,32.91 41.56,32.91 42.54,33.89 JP3.16
  Bottom 0.254: v33.7,33.42 34,33.72 34,35.29 32.36,36.93 32.36,37.71 32.91,38.26 32.91,39.26 v31.87,40.3
LED2  (via drill 0.35)
  Top 0.254: R1.1 26.59,39.79 | 26.59,39.79 26.78,39.61 U2.5 | 26.59,39.79 26.22,40.16 v25.48,40.16 | v33.35,34.73 33.87,35.25 43.73,35.25 44.1,34.88 44.1,32.67 JP3.14
  Bottom 0.254: v25.48,40.16 31.01,40.16 31.89,39.28 31.89,36.51 33.35,35.05 v33.35,34.73
LED3  (via drill 0.35)
  Top 0.254: R4.1 23.98,41.45 23.98,40.24 24.67,39.56 v24.67,39.37 25.25,38.79 U2.8 | v40.71,34 40.34,34.37 33.99,34.37 33.69,34.07 33.39,34.07 32.96,33.64 32.96,32.47 32.37,31.88 30.91,31.88 v30.19,32.6
  Bottom 0.254: v40.71,34 40.91,33.8 40.91,30.68 JP3.12 | v24.67,39.37 25.27,38.77 25.27,33.09 25.76,32.6 v30.19,32.6
LED4  (via drill 0.35)
  Top 0.152: 23.75,37.32 U2.11
  Top 0.254: R8.1 18.02,41.2 18.02,39.61 | 23.75,37.32 23.75,37.67 22.46,38.97 18.65,38.97 18.02,39.61 | 18.02,39.61 16.73,39.61 v16.45,39.32 | v16.24,36.39 19.83,36.39 19.92,36.48 21.18,36.48 v21.36,36.66 | v35.16,32.32 35.16,32.26 34.82,31.92 34.05,31.92 33.5,31.37 30.21,31.37 v29.66,31.92 | v36.38,33.61 39.94,33.61 v40.02,33.53 | JP3.10 41.01,28.04 v39.7,28.04
  Bottom 0.254: v16.45,39.32 16.45,36.6 v16.24,36.39 | v21.36,36.66 21.78,36.24 24.15,36.24 24.43,35.96 24.43,31.67 25.5,30.6 26.29,30.6 27.7,32.01 29.57,32.01 v29.66,31.92 | v40.02,33.53 40.02,32.73 40.39,32.36 40.39,28.73 v39.7,28.04 | v35.16,32.32 35.26,32.42 36.04,32.42 36.39,32.77 v36.38,33.61
N$1
  Top 0.254: R14.2 15.78,7.49 U7.41
N$2
  Top 0.254: R14.1 14.94,11.02 12.45,13.51 12.27,13.51 12.1,13.68 12.1,13.86 LED1.A
N$4
  Top 0.254: LED.A 11.24,18.48 R3.2
N$6
  Top 0.61: U$4.P$9 4.4,28.5 U$4.P$1 | U$4.P$1 U$4.P$7 U$4.P$6 U$4.P$2 4.4,21.5 U$4.P$10 | R7.1 3.47,30.33 2.68,29.54 U$4.P$1
N$8  (via drill 0.35)
  Top 0.254: v33.48,37.02 33.44,36.99 32.93,37.5 31,37.5 30.87,37.63 30.24,37.63 v29.58,38.29 29.41,38.29 28.76,37.64 U2.1 | v33.89,40.24 35.3,41.65 R9.2
  Bottom 0.254: v33.48,37.02 33.63,37.14 33.63,39.98 v33.89,40.24
N$9  (via drill 0.35)
  other vias: 26.4,34.69
N$10  (via drill 0.35)
  Top 0.254: v37.46,35.87 37.41,35.92 33.53,35.92 33.02,35.41 v32.05,35.41 | v37.91,31.68 37.82,31.59 R10.2 | v30.79,36.89 30.59,36.88 30.27,36.59 29.91,36.59 U2.38
  Bottom 0.254: v37.46,35.87 37.46,32.13 v37.91,31.68 | v32.05,35.41 32.03,35.43 32.03,35.73 30.81,36.94 v30.79,36.89
N$12
  Top 0.254: U2.13 21.97,36.15 21.77,35.95 20.94,35.95 20.66,35.67 19.87,35.67 19.53,35.33 R11.2
N$15
  Top 0.254: U2.12 22.64,37.74 R12.2
N$16  (via drill 0.35)
  Top 0.254: U2.6 26.24,37.15 26.24,39.07 26.01,39.3 v25.84,39.3 | v30.31,38.75 30.47,38.59 R13.2
  Bottom 0.254: v25.84,39.3 29.76,39.3 v30.31,38.75
N$17
  Top 0.254: R9.1 35.32,45.17 C15.2
N$18
  Top 0.254: R10.1 C17.2
N$19
  Top 0.254: C18.2 R11.1
N$20
  Top 0.254: R12.1 17.27,37.7 16.11,37.7 15.38,38.43 C19.2
N$29
  Top 0.203: C14.1 31.61,20.25 31.8,20.44 32.45,20.44 32.59,20.58 32.59,22.65 32.18,23.06 31.71,23.06 31.5,23.27 R17.1
  Top 0.254: Y1.3 36.17,26.59 35.63,27.14 32.92,27.14 32.67,26.89 32.67,24.35 32.47,24.15 R17.1
N$30
  Top 0.254: Y1.1 33.98,23.38 34.4,22.97 38.06,22.97 | C13.1 38.5,23.41 38.06,22.97 | R16.1 38,22.91 38.06,22.97
P0.0  (via drill 0.35)
  Top 0.254: U5.P$17 20.9,21.5 20.73,21.33 20.73,20.34 21.12,19.95 21.93,19.95 22.3,19.58 v22.3,19.4
  Bottom 0.254: JP4.3 22.93,14.21 22.3,14.83 v22.3,19.4
P0.1  (via drill 0.3)
  Top 0.203: v26.16,11.2 25.38,11.2 v24.86,10.68
  Top 0.254: v24.52,20.54 24.06,21 24.02,21 24,20.98 23.5,20.98 23.48,21 U5.P$18
  Bottom 0.203: v27.26,12.11 26.35,11.2 v26.16,11.2 | v24.86,10.68 25.05,10.87 JP5.1
  Bottom 0.254: v24.52,20.54 27.26,17.8 27.26,16.92 27.07,16.73 27.07,16.23 27.26,16.04 v27.26,12.11
P0.10  (via drill 0.35)
  Top 0.254: R16.2 36.1,20.13 v36.05,20.08 | v35.94,28.1 34.81,29.23 v29.8,29.23 | U5.P$29 29.04,25 v29.74,24.3
  Bottom 0.203: v36.05,20.08 37.83,20.08 38.16,20.41 38.16,27.39 37.56,27.99 36.05,27.99
  Bottom 0.254: 36.05,27.99 v35.94,28.1 | v29.8,29.23 29.8,28.77 30.15,28.42 30.15,28 29.97,27.82 29.8,27.82 29.52,27.54 29.52,24.52 v29.74,24.3
P0.11
  Top 0.254: U5.P$30 29.33,25.5 29.71,25.12 30.43,25.12 30.46,25.15 30.73,25.15 31.5,25.92 R17.2
P1.3  (via drill 0.35)
  Top 0.152: U5.P$13 22.59,23.5 v23.04,23.95
  Top 0.254: v24.52,23.92 24.97,23.92 25.08,23.84 25.08,23.21 24.83,22.96 24.83,21.6 25.37,21.06 25.37,19.96 24.79,19.26 v23.75,19.26
  Bottom 0.152: 25.05,14.84 25.05,15.42
  Bottom 0.254: v24.52,23.92 23.07,23.92 v23.04,23.95 | v23.75,19.26 23.75,16.72 25.05,15.42 JP4.1 25.05,14.84
P1.4  (via drill 0.35)
  Top 0.254: U5.P$12 19.87,24 v19.55,23.68 | v18.57,19.38 18.76,19.19 v21.37,19.19
  Bottom 0.203: 21.89,15.4 21.89,13.78 22.13,13.54 22.13,13.06 22.77,12.43
  Bottom 0.254: v18.57,19.38 18.57,23.52 18.71,23.66 19.54,23.66 v19.55,23.68 | v21.37,19.19 21.37,15.92 21.89,15.4 | 22.77,12.43 JP5.3
PWM_LED_1  (via drill 0.35)
  Top 0.254: U5.P$16 20.65,22 v19.91,21.26 | v23.84,27.59 23.84,29.13 v23.78,29.39 | v26.67,25.8 25.11,25.8 v24.59,25.52 | v32.49,34.57 32.41,34.65 31.69,34.65 31.17,35.17 30.54,35.17 30.18,34.81 30.15,34.81 29.99,34.65 U2.35
  Bottom 0.254: v26.67,25.8 27.56,25.8 28.08,25.28 28.08,22.87 27.99,22.78 26.79,22.78 26.61,22.6 26.34,22.6 26.27,22.53 23.66,22.53 23.17,22.04 20.69,22.04 v19.91,21.26 | v23.84,27.59 24.42,26.98 24.59,26.81 v24.59,25.52 | v23.78,29.39 23.66,29.4 24.31,30.05 26.72,30.05 27.95,31.28 30.41,31.28 31.61,32.48 31.61,33.76 31.49,33.88 31.49,34.07 31.75,34.33 32.25,34.33 v32.49,34.57
PWM_LED_2  (via drill 0.35)
  Top 0.254: v32.24,33.64 31.73,34.14 31.52,34.14 30.97,34.69 30.73,34.69 30.18,34.14 U2.34 | v31.57,30.03 28.68,30.03 v28.45,30.26 | U5.P$7 26.56,26.5 v26.66,26.6
  Bottom 0.254: v31.57,30.03 31.65,30.11 31.78,30.11 33.13,31.46 33.13,32.92 32.41,33.64 v32.24,33.64 | v28.45,30.26 28.45,27.12 27.91,26.58 26.68,26.58 v26.66,26.6
PWM_LED_3  (via drill 0.35)
  Top 0.254: U2.17 v21.57,34.14 | v20.47,23.37 20.64,23 U5.P$14 | v20.48,27.06 20.48,26.53 19.65,25.7 v19.65,25.67
  Bottom 0.254: v21.57,34.14 21.57,30.65 20.3,29.38 20.3,28.01 20.48,27.83 v20.48,27.06 | v20.47,23.37 20.48,23.18 20.48,24.84 v19.65,25.67
PWM_LED_4  (via drill 0.35)
  Top 0.254: v20.63,30.69 24.61,30.69 v24.52,30.67 | U2.16 21.94,34.65 v21.5,35.09 | v22.97,29.33 22.97,27.3 23.31,26.96 25.53,26.96 26.57,28 U5.P$35
  Bottom 0.254: v20.63,30.69 20.37,30.95 20.37,34.7 20.77,35.09 v21.5,35.09 | v24.52,30.67 22.87,30.67 22.86,30.66 22.86,29.55 v22.97,29.33
PWM_SERVO_BOTTOM  (via drill 0.35)
  Top 0.152: v26.66,21.96 26.66,22.13 25.75,23.04 25.75,24.31 26.07,24.63 26.53,24.63 26.66,24.5 U5.P$28
  Top 0.254: JP3.2 42.78,15.01 42.89,14.9 42.45,14.46 38.91,14.46 37.98,13.53 37.6,13.53 36.75,12.68 32.99,12.68 v32.96,12.71
  Bottom 0.203: 29.59,12.75 32.92,12.75 v32.96,12.71
  Bottom 0.254: v26.66,21.96 26.66,20.32 27.28,19.7 27.3,19.7 28.29,18.71 28.29,14.05 29.59,12.75
PWM_SERVO_TOP  (via drill 0.3, 0.35)
  Top 0.152: U5.P$23 27.31,22 27.21,21.9 27.21,21.73 26.89,21.41 26.87,21.41 26.36,20.9 26.36,20.84
  Top 0.203: v27.67,16.48 27.72,16.48 28.32,15.88
  Top 0.254: 26.36,20.84 v26.36,19.57 | v32.44,13.63 34.49,13.63 34.53,13.59 37.09,13.59 37.43,13.93 37.63,13.93 41.51,17.81 41.94,17.81 JP3.4 | 28.32,15.88 29.47,15.88 v29.96,16.37
  Bottom 0.203: v26.36,19.57 27.67,18.26 v27.67,16.48
  Bottom 0.254: v32.44,13.63 32.38,13.57 31.35,13.57 30.37,14.55 30.37,15.96 v29.96,16.37
REF
  Top 0.152: 28.89,35.85 28.97,35.77 29.34,35.77 U2.37 U2.36 28.93,35.16 28.89,35.2 28.89,35.85 | 23.14,35.85 22.93,35.64 U2.14 U2.15 23.13,35.16 23.14,35.17 23.14,35.85 | 23.14,35.85 23.19,35.91 23.19,36.3 23.37,36.48 25.5,36.48 25.63,36.62 25.63,36.99 U2.7 25.89,36.99 25.89,36.62 26.05,36.45 28.69,36.45 28.82,36.32 28.82,35.92 28.89,35.85
RESET
  Top 0.203: U6.1 U6.2
  Top 0.254: U6.2 22.11,16.33 21.19,16.33 19.92,15.06 19.92,8.79 20.12,8.59 U7.39
RX  (via drill 0.3)
  Top 0.152: v23.38,11.31 23.88,11.81 24.36,11.81 24.57,12.02 U7.24
  Bottom 0.203: JP5.2 24.24,11.93 23.62,11.31 v23.38,11.31 23.38,11.18 22.62,10.42 21.06,10.42 19.67,11.81
  Bottom 0.254: 19.67,11.81 19.67,16.11 19.67,16.44 18.09,18.02 JP1.3
SCL  (via drill 0.35)
  Top 0.254: v19.64,26.8 19.33,27.11 U3.1 15.46,26.84 15.46,25.55 14.8,24.89 13.63,24.89 12.52,26 11.81,26 11.46,26.35 11.46,27.81 v11.63,27.98 | U5.P$27 26.38,24 v26.3,24.08 | R6.1 10.98,31.3 v11.08,31.2
  Bottom 0.254: v11.08,31.2 11.08,28.53 v11.63,27.98 | v26.3,24.08 26.3,24.61 26.18,24.73 24.27,24.73 23.73,25.27 23.13,25.27 23.03,25.37 21.19,25.37 21.19,26.4 21.02,26.57 20.76,26.31 20.13,26.31 v19.64,26.8
SCLK  (via drill 0.3, 0.35)
  Top 0.15: U7.43 18.99,6.39 v18.95,6.35
  Top 0.254: v36.93,18.37 36.29,18.37 35.89,17.97 34.43,17.97 v34.29,18.01
  Bottom 0.254: v34.29,18.01 33.02,16.74 U$1.4 | v18.95,6.35 34.95,6.35 35.69,7.09 35.69,11.05 38.03,13.39 38.07,13.39 39.31,14.63 39.31,15.99 v36.93,18.37
SDA  (via drill 0.35)
  Top 0.254: U3.3 13.92,28.99 v13.86,29.05 | v13.44,31.57 13.32,31.69 R5.1 | U5.P$15 22.83,22.5 v23.75,21.58 | v15.39,19.37 16.06,20.04 19.75,20.04 v19.77,20.02
  Bottom 0.254: v13.44,31.57 13.86,31.15 v13.86,29.05 13.86,25.14 13.96,25.04 13.96,19.91 14.5,19.37 v15.39,19.37 | v19.77,20.02 23.36,20.02 23.75,20.41 v23.75,21.58
SDIO  (via drill 0.3, 0.35)
  Top 0.254: v36.72,17.47 36.65,17.4 31.97,17.4 31.75,17.18 U$1.2 | U7.44 23.08,5.84 v24.22,6.98
  Bottom 0.254: v24.22,6.98 24.84,7.6 34.14,7.6 34.45,7.91 34.45,11.03 37.74,14.32 37.74,16.69 36.96,17.47 v36.72,17.47
SW1  (via drill 0.35)
  Top 0.254: D1.A 31.82,43.41 | 31.82,43.41 v31.86,43.37 | U2.29 27.79,32.16 27.79,30.54 27.09,29.84 27.09,29.53 25.2,27.64 v25.09,27.64 | v19.67,27.84 20.56,27.84 v20.94,28.22 | L6.2 31.82,44.02 31.82,43.41
  Bottom 0.254: v31.86,43.37 31.86,47.14 31.18,47.82 27.42,47.82 26.19,49.05 25.8,49.44 23.94,49.44 23.46,48.97 22.62,48.97 22.34,48.68 19.04,48.68 18.81,48.45 18.2,48.45 17.28,47.53 17.28,29.87 19.31,27.84 v19.67,27.84 | v20.94,28.22 24.26,28.22 24.84,27.64 v25.09,27.64
SW2  (via drill 0.35)
  Top 0.254: U2.27 26.78,30.32 25.8,29.34 v24.89,29.34 | L5.2 26.54,43.56 D3.A 27.5,43.41 v27.54,43.37 | v20.97,29.12 20.77,29.32 20.27,29.32 v19.67,28.72
  Bottom 0.152: 25.15,49.01 24.24,49.01
  Bottom 0.203: 17.9,30 17.9,46.69 19.37,48.16 19.37,48.17 22.46,48.17 22.82,48.53 23.76,48.53 24.24,49.01 | 27.54,46.62 25.15,49.01
  Bottom 0.254: 27.54,46.62 v27.54,43.37 | 17.9,30 18.23,29.66 18.65,29.66 19.59,28.72 v19.67,28.72 | v24.89,29.34 24.87,29.32 24.73,29.32 24.13,28.72 21.79,28.72 21.19,29.32 21.17,29.32 v20.97,29.12
SW3  (via drill 0.35)
  Top 0.203: v19.29,30.59 19.86,30.02 20.18,30.02
  Top 0.254: U2.25 v25.76,31.22 25.76,30.65 25.13,30.02 20.18,30.02 | D4.A 22.09,43.56 L4.2
  Top 0.508: v21.04,43.39 21.92,43.39 D4.A
  Bottom 0.203: 19.69,31.35 19.29,30.95 v19.29,30.59
  Bottom 0.254: v21.04,43.39 19.85,43.41 19.69,43.25 19.69,31.35 19.3,30.96 v19.29,30.59
SW4  (via drill 0.35)
  Top 0.254: L3.2 17.65,43.56 D5.A 18.62,43.41 v18.66,43.37 | U2.23 24.77,31.5 24.55,31.28 22.13,31.28 21.62,31.79 19.88,31.79 19.37,31.28 v18.7,31.28
  Bottom 0.254: v18.66,43.37 18.66,31.32 v18.7,31.28
SWCLK  (via drill 0.35)
  Top 0.254: U5.P$34 32.27,27.5 v33.05,28.28 | U$3.4 37.7,38.97 37.22,39.45 35.41,39.45 v35.27,39.31
  Bottom 0.254: v33.05,28.28 35.27,30.5 35.27,31.35 34.93,31.69 34.52,31.69 34.14,32.07 34.14,32.26 35.27,33.39 v35.27,39.31
SWD  (via drill 0.35)
  Top 0.254: U$3.2 35.53,38.34 35.3,38.1 35.3,38.09 v34.32,37.11 | v32.61,29.98 32.68,29.91 33.57,29.91 v34.54,30.88 | U5.P$33 29.98,27 v30.18,26.8
  Bottom 0.254: v32.61,29.98 31.68,29.05 31.68,27.87 31.36,27.55 30.93,27.55 v30.18,26.8 | v34.54,30.88 33.56,31.86 33.56,32.39 34.54,33.37 34.54,36.52 34.55,36.53 34.55,36.88 v34.32,37.11
TOP_SERVO_POS  (via drill 0.35)
  Top 0.254: U5.P$31 28.77,26 29.05,26.28 29.7,26.28 v30.13,25.85 | v35.05,19.57 35.55,19.07 39.12,19.07 39.97,19.92 39.97,23.31 40.31,23.66 40.39,23.73 JP3.8
  Bottom 0.254: v30.13,25.85 31.66,24.32 31.66,22.97 v35.05,19.58 v35.05,19.57
TX  (via drill 0.3)
  Top 0.152: U7.22 25.67,11.98 24.9,11.21 24.64,11.21 24.09,10.66 24.09,9.5 24.4,9.19 24.97,9.19 v25.44,8.72
  Top 0.254: v23,17.51 22.82,17.33 21.62,17.33 20.49,16.2 v19.09,16.2
  Bottom 0.152: 25.44,11.51 25.44,11.47
  Bottom 0.203: JP4.2 24.24,13.51 24.43,13.31 25.47,13.31 25.62,13.17 25.62,11.69 25.44,11.51
  Bottom 0.254: 25.44,11.47 v25.44,8.72 | JP4.2 24.24,15.66 23.35,16.55 23.35,17.16 v23,17.51 | v19.09,16.2 8.2,16.2 JP1.1
XL1  (via drill 0.3)
  Top 0.152: Y6.2 18.84,13.39
  Top 0.203: U7.13 31.3,11.89 v31.34,11.85 | v19.23,10.76 19.23,13 18.84,13.39 | v24.62,9.72 25.52,9.72 v26.2,10.4
  Top 0.254: Y6.2 17.37,17.16 C28.2
  Bottom 0.203: v31.34,11.85 30.25,10.76 26.56,10.76 v26.2,10.4 | v24.62,9.72 21.19,9.72 20.27,9.72 v19.23,10.76
XL2  (via drill 0.3)
  Top 0.203: U7.14 27.55,11.37 27.2,11.37 26.79,10.96 v26.79,9.85 | v14.95,12.42 14.95,14.84 Y6.1
  Top 0.254: C27.1 13.55,14.86 Y6.1
  Bottom 0.203: v14.95,12.42 17.52,9.85
  Bottom 0.254: 17.52,9.85 19.25,8.12 26.51,8.12 26.79,8.4 v26.79,9.85

### Text on the board
tNames: 1 | LED1 | 5V | LED2 | 5V | LED3 | 5V | Moving_Head_V3.1 | LED4 | 5V | 5V | TSP | 5V | BSP | 5V | GND | PST | GND | 3.3V | RX | TX | PSB | GND | GND | HW: Tobias Heigl / SW: Andreas Laubhahn | 1